# EAGLE design SparkFun CAN-Bus Shield v20 (EAGLE 9.6.2)
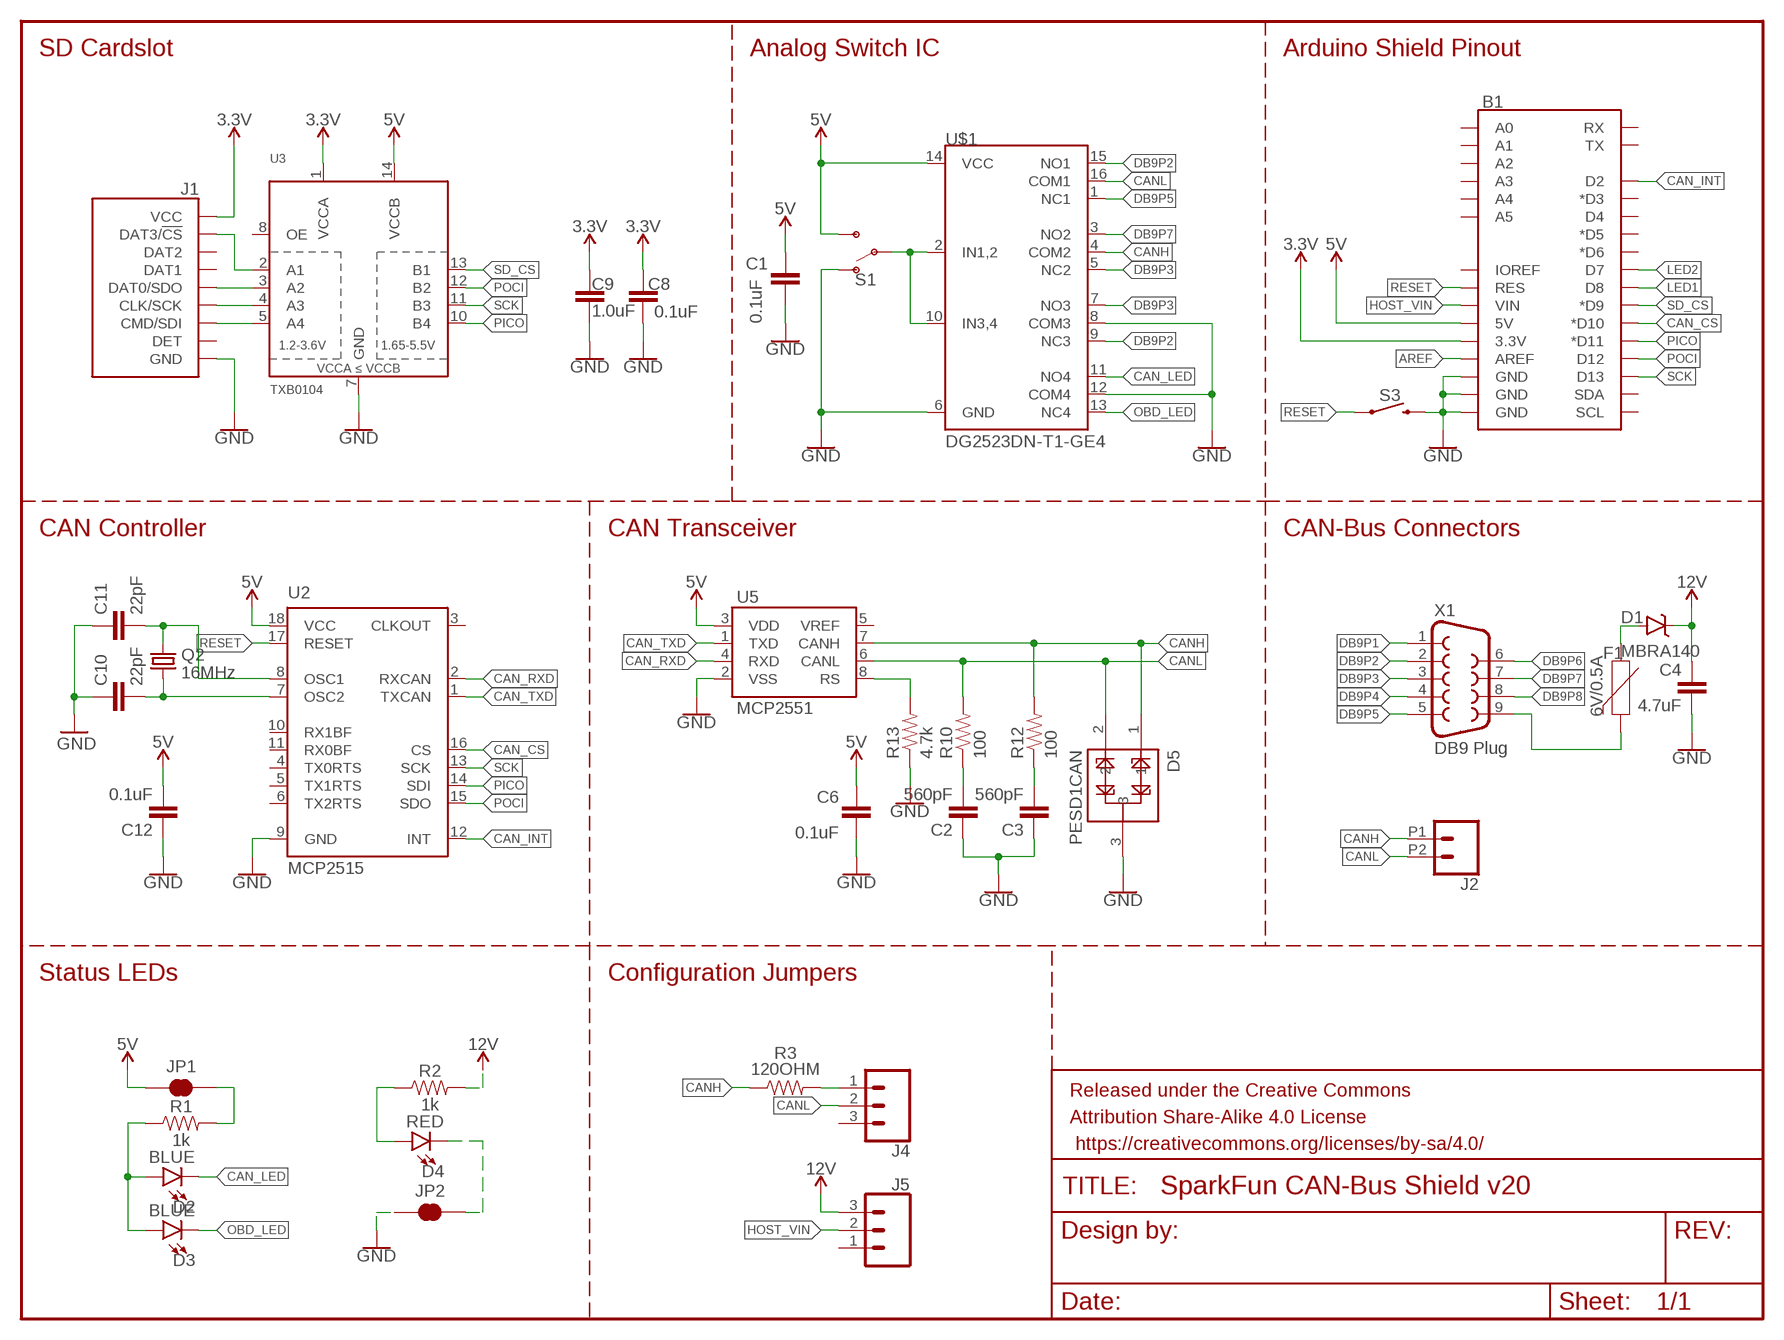
[diagram p0: schematic, sheet 1]

## Parts
B1  ARDUINO_UNO_R3_SHIELDUNO_R3_SHIELD_LOCK  [UNO_R3_SHIELD_LOCK]
C1  0.1uF  0.1UF-0603-25V-(+80/-20%)  [0603]
C2  560pF  560PF-0603-50V-5%  [0603]
C3  560pF  560PF-0603-50V-5%  [0603]
C4  4.7uF  4.7UF-0603-35V-(20%)  [0603]
C6  0.1uF  0.1UF-0603-25V-(+80/-20%)  [0603]
C8  0.1uF  0.1UF-0603-25V-(+80/-20%)  [0603]
C9  1.0uF  1.0UF-0603-16V-10%  [0603]
C10  22pF  22PF-0603-50V-5%  [0603]
C11  22pF  22PF-0603-50V-5%  [0603]
C12  0.1uF  0.1UF-0603-25V-(+80/-20%)  [0603]
D1  MBRA140  [SMA-DIODE]
D2  BLUE  LED-BLUE0603  [LED-0603]
D3  BLUE  LED-BLUE0603  [LED-0603]
D4  RED  LED-RED0603  [LED-0603]
D5  PESD1CAN  [SOT23-3]
F1  6V/0.5A  PPTC_6V500MA-2  [1206]
FRAME1  FRAME-LETTER  [CREATIVE_COMMONS]
J1  MICRO-SD-PUSH-PUSH-EXT-PIN  [MICROSD-EXTERNALPIN]
J2  CONN_022.54MM_SCREWTERM  [1X02_2.54_SCREWTERM]
J4  CONN_031X03_NO_SILK  [1X03_NO_SILK]
J5  CONN_031X03_NO_SILK  [1X03_NO_SILK]
JP1  JUMPER-SMT_2_NC_TRACE_NO-SILK  [SMT-JUMPER_2_NC_TRACE_NO-SILK]
JP2  JUMPER-SMT_2_NC_TRACE_NO-SILK  [SMT-JUMPER_2_NC_TRACE_NO-SILK]
Q2  16MHz  CRYSTAL-16MHZSMD-5X3.2  [CRYSTAL-SMD-5X3.2-4PAD]
R1  1k  1KOHM-0603-1/10W-1%  [0603]
R2  1k  1KOHM-0603-1/10W-1%  [0603]
R3  120OHM  [0603]
R10  100  100OHM-0603-1/10W-1%  [0603]
R12  100  100OHM-0603-1/10W-1%  [0603]
R13  4.7k  4.7KOHM-0603-1/10W-1%  [0603]
S1  SWITCH-SPDT-SMD-AYZ0202  [SWITCH_DPDT_SMD_AYZ0202]
S3  MOMENTARY-SWITCH-SPST-SMD-5.2-TALL-REDUNDANT  [TACTILE_SWITCH_SMD_5.2MM]
U2  MCP2515  MCP2515(MCP2510)SO  [SO18W]
U3  TXB0104  TXB0104PWRSOIC14  [SO14]
U5  MCP2551  [SO08]
U$1  DG2523DN-T1-GE4  [QFN16-3X3MM_1:1_V03]
X1  DB9 Plug  DB9MALE  [DB9_MALE]

## Nets
3.3V: B1.3.3V C8.2 C9.1 J1.4(VCC) U3.1(VCCA)
5V: B1.5V C1.2 C6.2 C12.2 JP1.1 S1.3(S) U2.18(VCC) U3.14(VCCB) U5.3(VDD) U$1.14(VCC)
12V: C4.1 D1.C J5.3 R2.2
AREF: B1.AREF
CAN_CS: B1.D10(*D10) U2.16(CS)
CAN_INT: B1.D2 U2.12(INT)
CAN_LED: D2.C U$1.11(NO4)
CAN_RXD: U2.2(RXCAN) U5.4(RXD)
CAN_TXD: U2.1(TXCAN) U5.1(TXD)
CANH: D5.1 J2.P1 R3.1 R12.2 U5.7(CANH) U$1.4(COM2)
CANL: D5.2 J2.P2 J4.2 R10.2 U5.6(CANL) U$1.16(COM1)
DB9P1: X1.1
DB9P2: U$1.9(NC3) U$1.15(NO1) X1.2
DB9P3: U$1.5(NC2) U$1.7(NO3) X1.3
DB9P4: X1.4
DB9P5: U$1.1(NC1) X1.5
DB9P6: X1.6
DB9P7: U$1.3(NO2) X1.7
DB9P8: X1.8
GND: B1.GND@0(GND) B1.GND@1(GND) B1.GND@2(GND) C1.1 C2.1 C3.1 C4.2 C6.1 C8.1 C9.2 C10.1 C11.1 C12.1 D5.3 J1.6(GND) J1.10(GND) J1.11(GND) J1.12(GND) J1.13(GND) JP2.1 R13.1 S3.3 S3.4 U2.9(GND) U3.7(GND) U5.2(VSS) U$1.8(COM3) U$1.12(COM4)
HOST_VIN: B1.VIN J5.2
LED1: B1.D8
LED2: B1.D7
N$1: C11.2 Q2.3 U2.8(OSC1)
N$2: C10.2 Q2.1 U2.7(OSC2)
N$3: J1.2(DAT3/!CS!) U3.2(A1)
N$4: S1.1(O) U$1.6(GND) ; supply symbol labelled GND
N$5: J1.7(DAT0/SDO) U3.3(A2)
N$6: J1.5(CLK/SCK) U3.4(A3)
N$7: J1.3(CMD/SDI) U3.5(A4)
N$8: D4.A R2.1
N$9: C2.2 R10.1
N$10: C3.2 R12.1
N$11: JP1.2 R1.2
N$12: D2.A D3.A R1.1
N$13: F1.2 X1.9
N$14: R13.2 U5.8(RS)
N$15: D4.C JP2.2
N$16: D1.A F1.1
N$17: J4.1 R3.2
N$21: S1.2(P) U$1.2(IN1,2) U$1.10(IN3,4)
OBD_LED: D3.C U$1.13(NC4)
PICO: B1.D11(*D11) U2.14(SDI) U3.10(B4)
POCI: B1.D12 U2.15(SDO) U3.12(B2)
RESET: B1.RES S3.1 S3.2 U2.17(RESET)
SCK: B1.D13 U2.13(SCK) U3.11(B3)
SD_CS: B1.D9(*D9) U3.13(B1)
Unconnected: B1.A0 B1.A1 B1.A2 B1.A3 B1.A4 B1.A5 B1.D3(*D3) B1.D4 B1.D5(*D5) B1.D6(*D6) B1.IOREF B1.RX B1.SCL B1.SDA B1.TX J1.1(DAT2) J1.8(DAT1) J1.9(DET) J4.3 J5.1 U2.3(CLKOUT) U2.4(TX0RTS) U2.5(TX1RTS) U2.6(TX2RTS) U2.10(RX1BF) U2.11(RX0BF) U3.8(OE) U5.5(VREF)

## Notes on the sheet
- SD Cardslot | Analog Switch IC | Arduino Shield Pinout
- CAN Controller | CAN Transceiver | CAN-Bus Connectors
- Status LEDs | Configuration Jumpers

## Library data of the parts
B1 = SparkFun-Boards:ARDUINO_UNO_R3_SHIELD: Arduino R3 Shield Footprint Shield form compatible with the Arduino Uno R3. SparkFun Products: MG2639 Cellular Shield <https://www.sparkfun.com/products/13120> MIDI Shield <https://www.sparkfun.com/products/12898> R3 Stackable Headers Kit <https://www.sparkfun.com/products/11417>
C1 C6 C8 C12 = SparkFun-Capacitors:0.1UF: 0.1µF ceramic capacitors A capacitor is a passive two-terminal electrical component used to store electrical energy temporarily in an electric field.; PROD_ID: CAP-00810
C2 C3 = SparkFun-Capacitors:560PF: 0.56nF/560pF ceramic capacitors A capacitor is a passive two-terminal electrical component used to store electrical energy temporarily in an electric field.; PROD_ID: CAP-08749
C4 = SparkFun-Capacitors:4.7UF: 4.7µF ceramic capacitors A capacitor is a passive two-terminal electrical component used to store electrical energy temporarily in an electric field.; PROD_ID: CAP-14106
C9 = SparkFun-Capacitors:1.0UF: 1µF ceramic capacitors A capacitor is a passive two-terminal electrical component used to store electrical energy temporarily in an electric field.; PROD_ID: CAP-00868
C10 C11 = SparkFun-Capacitors:22PF: 22pF ceramic capacitors A capacitor is a passive two-terminal electrical component used to store electrical energy temporarily in an electric field.; PROD_ID: CAP-07876
D1 = SparkFun-DiscreteSemi:MBRA140: 40V, 1A Schottky rectifier SMA/DO-214AC package DIO-08053; PROD_ID: DIO-08053
D2 D3 = SparkFun-LED:LED-BLUE: Blue SMD LED Used in manufacturing of various products at SparkFun Packages: 0603 - SMD 0603 package [Product Link] <http://www.digikey.com/product-detail/en/SMLE12BC7TT86/511-1589-2-ND/1641808> 1206 - SMD1206 package [Product Link] <http://www.digikey.com/product-detail/en/lite-on-inc/LTST-C150TBKT/160-1643-1-ND/573584> SparkFun Products: ESP8266 Thing-Dev Board <https://www.sparkfun.com/products/13711> RedBoard <https://www.sparkfun.com/products/12757>; PROD_ID: DIO-08575
D4 = SparkFun-LED:LED-RED: Red SMD LED Used in manufacturing of most products at SparkFun Packages: 0603 - SMD 0603 package [Product Link] <http://docs.avagotech.com/docs/AV02-0551EN> 0603 SMART - SMD 0603 SMART package ( more efficient and expensive)[Product Link] <http://www.osram-os.com/Graphics/XPic2/00077099_0.pdf> 1206 - SMD1206 package [Product Link] <https://www.sparkfun.com/datasheets/DevTools/LilyPad/Q150OVS4.pdff> SparkFun Products: Pro Mini 328 -5V <https://www.sparkfun.com/products/821> RedBoard <https://www.sparkfun.com/products/12757> IOIO-OTG <https://www.sparkfun.com/products/13613>; PROD_ID: DIO-00819
D5 = SparkFun-DiscreteSemi:PESD1CAN: PESD1CAN is used to protect two automotive CAN bus lines from ESD.; PROD_ID: DIO-12501
F1 = SparkFun-Fuses:PPTC: Resettable Fuse PPTC Resettable Fuse. Really a sort of resistor with a polymeric positive temperature coefficient whose resistance increases dramatically with an increase in temperature. When heated by the power passing through the resistance rises causing the current to be limited, protecting the circuit. This is achieved by the transition of the polymer from a crystalline to an amorphous state where the conductive carbon separates breaking the conductive pathways found in the cool crystalline structure. When a PPTC cools back down it resumes conducting letting the circuit turn back on. SparkFun Products: SparkFun RedBoard - Programmed with Arduino <https://www.sparkfun.com/products/12757> Pro Micro - 5V/16MHz <https://www.sparkfun.com/products/12640> Arduino Pro 328 - 5V/16MHz <https://www.sparkfun.com/products/10915> MP3 Trigger <https://www.sparkfun.com/products/13720>; PROD_ID: RES-08585
FRAME1 = SparkFun-Aesthetics:FRAME-LETTER: Schematic Frame - Letter Standard 8.5x11 US Letter frame
J1 = SparkFun-Connectors:MICRO-SD: microSD Socket for Transflash Various sockets for µSD. tDoc lines correctly indicate media card edge positions when inserting (unlocked, locked, depressed). NOTE: CD1 and CD2 are connected internally, and the default detect state of the socket is detect pin to ground. SparkFun Products: WAV Trigger <https://www.sparkfun.com/products/13660> CAN-Bus Shield <https://www.sparkfun.com/products/13262> SparkFun Level Shifing microSD Breakout <https://www.sparkfun.com/products/13743>; PROD_ID: CONN-16110
J2 = SparkFun-Connectors:CONN_02: Multi connection point. Often used as Generic Header-pin footprint for 0.1 inch spaced/style header connections On any of the 0.1 inch spaced packages, you can populate with these: Break Away Headers - Straight <https://www.sparkfun.com/products/116> (PRT-00116) Break Away Male Headers - Right Angle <https://www.sparkfun.com/products/553> (PRT-00553) Female Headers <https://www.sparkfun.com/products/115> (PRT-00115) Break Away Headers - Machine Pin <https://www.sparkfun.com/products/117> (PRT-00117) Break Away Female Headers - Swiss Machine Pin <https://www.sparkfun.com/products/743> (PRT-00743) For SCREWTERMINALS and SPRING TERMINALS visit here: Screw Terimnals on SparkFun.com <https://www.sparkfun.com/search/results?term=Screw+Terminals> (5mm/3.5mm/2.54mm spacing) This device is also useful as a general connection point to wire up your design to another part of your project. Our various solder wires solder well into these plated through hole pads. Hook-Up Wire - Assortment (Stranded, 22 AWG) <https://www.sparkfun.com/products/11375> (PRT-11375) Hook-Up Wire - Assortment (Solid Core, 22 AWG) <https://www.sparkfun.com/products/11367> (PRT-11367) View the entire wire category on our website here <https://www.sparkfun.com/categories/141> Special notes: Molex polarized connector foot print use with: PRT-08233 with associated crimp pins and housings. 2.54_SCREWTERM for use with PRT-10571. 3.5mm Screw Terminal footprints for PRT-08084 5mm Screw Terminal footprints for use with PRT-08432
J4 J5 = SparkFun-Connectors:CONN_03: Multi connection point. Often used as Generic Header-pin footprint for 0.1 inch spaced/style header connections On any of the 0.1 inch spaced packages, you can populate with these: Break Away Headers - Straight <https://www.sparkfun.com/products/116> (PRT-00116) Break Away Male Headers - Right Angle <https://www.sparkfun.com/products/553> (PRT-00553) Female Headers <https://www.sparkfun.com/products/115> (PRT-00115) Break Away Headers - Machine Pin <https://www.sparkfun.com/products/117> (PRT-00117) Break Away Female Headers - Swiss Machine Pin <https://www.sparkfun.com/products/743> (PRT-00743) Stackable Header - 3 Pin (Female, 0.1") <https://www.sparkfun.com/products/13875> (PRT-13875) For SCREWTERMINALS and SPRING TERMINALS visit here: Screw Terimnals on SparkFun.com <https://www.sparkfun.com/search/results?term=Screw+Terminals> (5mm/3.5mm/2.54mm spacing) This device is also useful as a general connection point to wire up your design to another part of your project. Our various solder wires solder well into these plated through hole pads. Hook-Up Wire - Assortment (Stranded, 22 AWG) <https://www.sparkfun.com/products/11375> (PRT-11375) Hook-Up Wire - Assortment (Solid Core, 22 AWG) <https://www.sparkfun.com/products/11367> (PRT-11367) View the entire wire category on our website here <https://www.sparkfun.com/categories/141> Special notes: Molex polarized connector foot print use with SKU : PRT-08232 with associated crimp pins and housings.
JP1 JP2 = SparkFun-Jumpers:JUMPER-SMT_2_NC_TRACE: Normally closed trace jumper This jumper has a trace between two pads so it's normally closed (NC). Use a razor knife to open the connection. For best results follow the IPC guidelines for cutting traces: Cutout at least 0.063 mm (0.005 in). Remove all loose material to clean up the cut area. Seal the cut with an approved epoxy. Reapply solder to reclose the connection.
Q2 = SparkFun-Clocks:CRYSTAL-16MHZ: 16MHz Crystal Digikey Example <http://www.digikey.com/product-search/en?keywords=535-9122-1-ND> Frequency: 16MHz Frequency Stability: ±50ppm Frequency Tolerance: ±20ppm Load Capacitance: 18pF SparkFun Products: Pro Micro -5V/16MHz <https://www.sparkfun.com/products/12640> SparkFun Serial Enabled LCD Kit <https://www.sparkfun.com/products/10097>; PROD_ID: XTAL-08218; SF_ID: COM-00094
R1 R2 = SparkFun-Resistors:1KOHM: 1kΩ resistor A resistor is a passive two-terminal electrical component that implements electrical resistance as a circuit element. Resistors act to reduce current flow, and, at the same time, act to lower voltage levels within circuits. - Wikipedia; PROD_ID: RES-07856
R3 = SparkFun-Resistors:120OHM: 120Ω resistor A resistor is a passive two-terminal electrical component that implements electrical resistance as a circuit element. Resistors act to reduce current flow, and, at the same time, act to lower voltage levels within circuits. - Wikipedia
R10 R12 = SparkFun-Resistors:100OHM: 100Ω resistor A resistor is a passive two-terminal electrical component that implements electrical resistance as a circuit element. Resistors act to reduce current flow, and, at the same time, act to lower voltage levels within circuits. - Wikipedia; PROD_ID: RES-07863
R13 = SparkFun-Resistors:4.7KOHM: 4.7kΩ resistor A resistor is a passive two-terminal electrical component that implements electrical resistance as a circuit element. Resistors act to reduce current flow, and, at the same time, act to lower voltage levels within circuits. - Wikipedia; PROD_ID: RES-07857
S1 = SparkFun-Switches:SWITCH-SPDT: Single Pole, Double Throw (SPDT) Switch Single-pole, double-throw (SPDT) switch. Variant Overview SMD-AYZ0202 Surface Mount DPDT Switch <https://www.sparkfun.com/products/597> (COM-00597) Used on e.g. LilyPad Arduino USB - ATmega32U4 Board <https://www.sparkfun.com/products/12049> PTH-11.6X4.0MM SPDT Mini Power Switch <https://www.sparkfun.com/products/102> (COM-00102) Used on e.g. SparkFun Simon Says - Through-Hole Soldering Kit <https://www.sparkfun.com/products/10547> (KIT-10547) PTH-11.6X4.0MM-KIT KIT version of SPDT Mini Power Switch - Simplifies soldering by removing tStop of switch pins - only one side can be soldered. PTH-11.6X4.0MM-LOCK LOCK version of SPDT Mini Power Switch - Offset pins hold switch in place for easier soldering. SMD-RIGHT-ANGLE Surface Mount Right Angle Switch <https://www.sparkfun.com/products/10860> (COM-10860) Used on e.g. SparkFun ESP8266 Thing <https://www.sparkfun.com/products/13231>; PROD_ID: SWCH-08179; SF_ID: COM-00597
S3 = SparkFun-Switches:MOMENTARY-SWITCH-SPST: Momentary Switch (Pushbutton) - SPST Normally-open (NO) SPST momentary switches (buttons, pushbuttons). Variants PTH-12MM - 12mm square, through-hole Momentary Pushbutton Switch - 12mm Square <https://www.sparkfun.com/products/9190> (COM-09190) PTH-6.0MM, PTH-6.0MM-KIT - 6.0mm square, through-hole Mini Pushbutton Switch <https://www.sparkfun.com/products/97> (COM-00097) KIT package intended for soldering kit's - only one side of pads' copper is exposed. PTH-RIGHT-ANGLE-KIT - Right-angle, through-hole Right Angle Tactile Button <https://www.sparkfun.com/products/10791> - Used on SparkFun BigTime Watch Kit <https://www.sparkfun.com/products/11734> SMD-12MM - 12mm square, surface-mount Tactile Button - SMD (12mm) <https://www.sparkfun.com/products/12993> (COM-12993) Used on SparkFun PicoBoard <https://www.sparkfun.com/products/11888> SMD-4.5MM - 4.5mm Square Trackball Switch Used on SparkFun Blackberry Trackballer Breakout <https://www.sparkfun.com/products/13169> SMD-4.6MMX2.8MM - 4.60mm x 2.80mm, surface mount Used on SparkFun Pro Micro - RP2040 <https://www.sparkfun.com/products/17717> SMD-5.2MM, SMD-5.2-REDUNDANT - 5.2mm square, surface-mount Mini Pushbutton Switch - SMD <https://www.sparkfun.com/products/8720> (COM-08720) Used on Arduino Pro Mini <https://www.sparkfun.com/products/11114> REDUNDANT package connects both switch circuits together SMD-6.0X3.5MM - 6.0 x 3.5mm, surface mount Momentary Reset Switch SMD <https://www.sparkfun.com/products/8229> (COM-08229) SMD-6.2MM-TALL - 6.2mm square, surface mount Tactile Button - SMD (6mm) <https://www.sparkfun.com/products/12992> Used on SparkFun Digital Sandbox <https://www.sparkfun.com/products/12651> SMD-RIGHT-ANGLE - Right-angle, surface mount Used on SparkFun Block for Intel® Edison - Arduino <https://www.sparkfun.com/products/13036>; PROD_ID: SWCH-14139
U2 = SparkFun-IC-Comms:MCP2515(MCP2510): CAN controller with SPI interface The MCP2515 controller supercedes the MCP2510 while addressing all errata associated with it. The two devices are pin compatible, either can be used with this device. 18-pin package SOIC Simple SPI interface to any MCU. One-shot mode ensures message transmission is attempted only once Databyte filtering Start-of-Frame (SOF) output Low-power CMOS Technology Datasheet <http://www.sparkfun.com/datasheets/DevTools/Arduino/MCP2515.pdf> SparkFun Products CAN-BUS Shield <https://www.sparkfun.com/products/13262> (DEV-13262); PROD_ID: IC-09906
U3 = SparkFun-IC-Comms:TXB0104PWR: 4-Bit Bi-Directional Level Shifter 1.2V-3.6V (VCCA) to 1.65V-5.5V (VCCB) bi-directional level shifter with auto direction sensing. Max data rate - VCCA 1.8V: 20Mbps (50ns), VCCA 3.3V: 100Mbps (10ns) Digikey: 296-21929-1-ND (TSSOP) Datasheet <http://cdn.sparkfun.com/datasheets/BreakoutBoards/txb0104.pdf> SparkFun Products SparkFun Cellular Shield - MG2639 <https://www.sparkfun.com/products/13120> (CEL-13120) SparkFun Level Shifting microSD Breakout <https://www.sparkfun.com/products/13743> (DEV-13743) SparkFun Voltage-Level Translator Breakout - TXB0104 <https://www.sparkfun.com/products/11771> (BOB-11771) SparkFun Block for Intel® Edison - UART <https://www.sparkfun.com/products/13040> (DEV-13040) SparkFun Block for Intel® Edison - Arduino <https://www.sparkfun.com/products/13036> (DEV-13036); PROD_ID: IC-11329
U5 = SparkFun-IC-Comms:MCP2551: MCP2551 High Speed CAN Transceiver High speed CAN transceiver Datasheet <http://www.sparkfun.com/datasheets/DevTools/Arduino/MCP2551.pdf> SparkFun Products CAN-BUS Shield <https://www.sparkfun.com/products/13262> (DEV-13262) SparkFun OBD-II UART <https://www.sparkfun.com/products/9555> (WIG-09555); PROD_ID: IC-09907
U$1 = SparkFun-IC-Special-Function:DG2523DN-T1-GE4
X1 = SparkFun-Connectors:DB9: DB9 Connector Standard DB9 (D-Sub 9) serial connector. Can be used for CAN bus as well as RS485 and RS232. Footprint production proven. Spark Fun Electronics SKU : PRT-00429; PROD_ID: CONN-09904

## Board
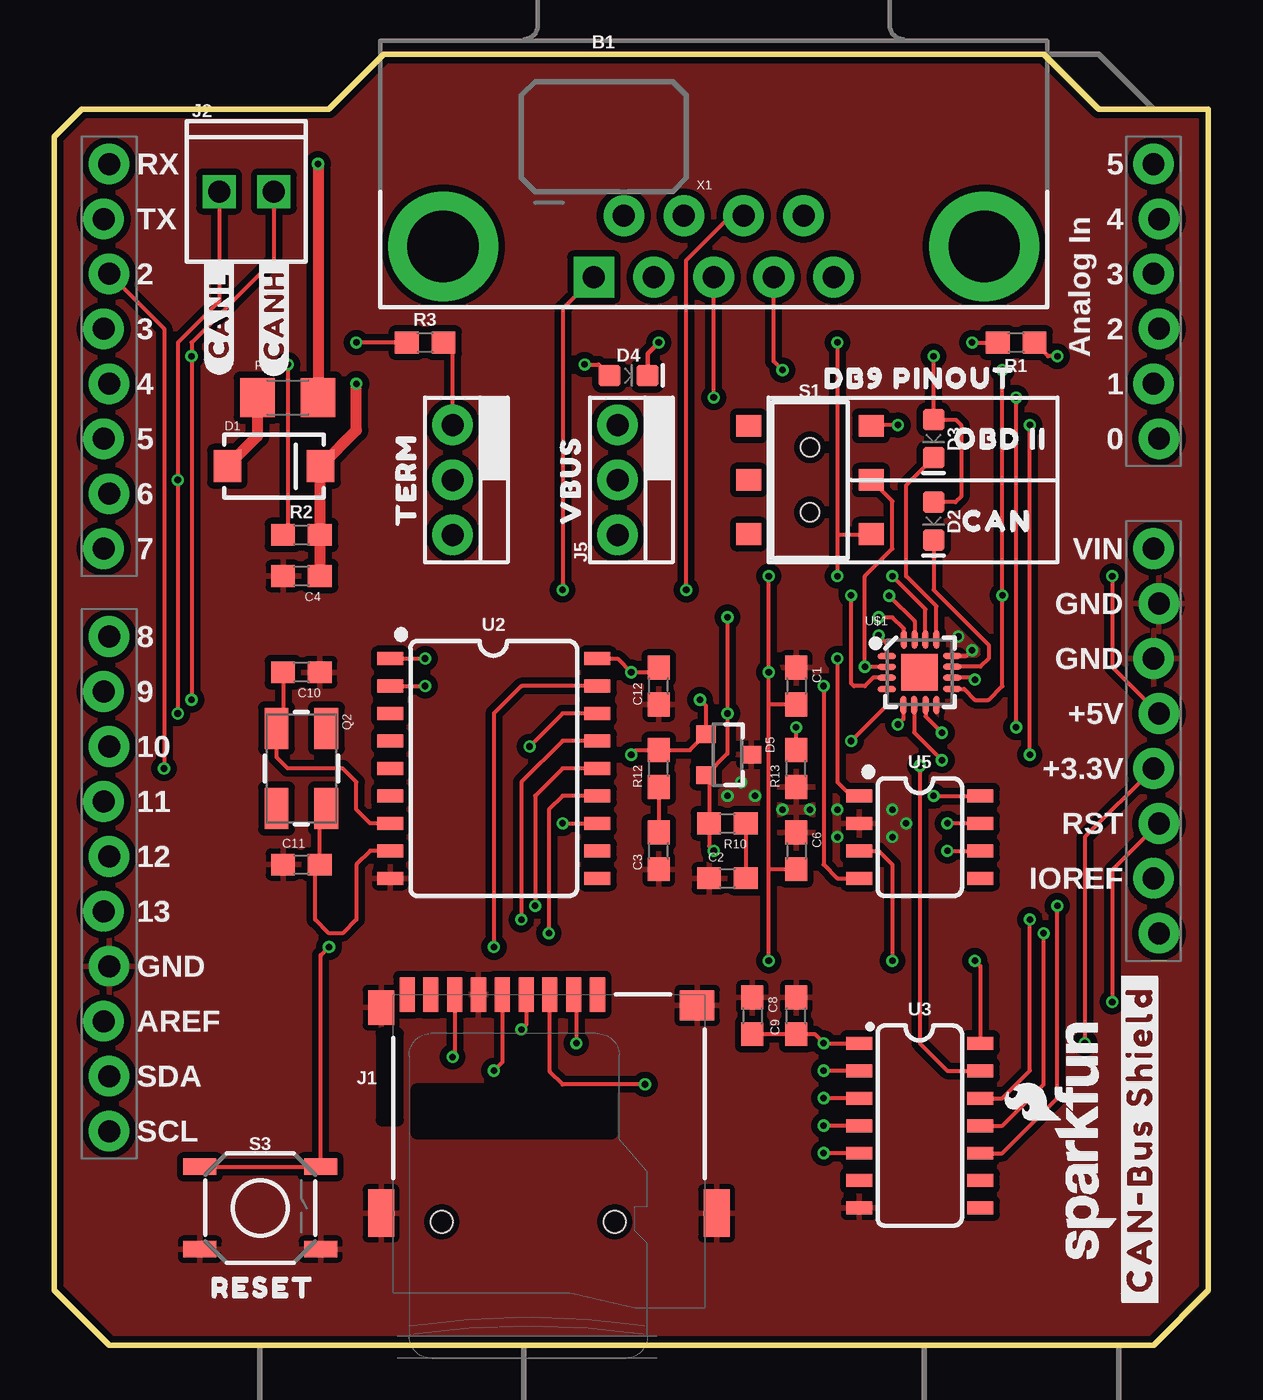
[diagram p1: board, top side]
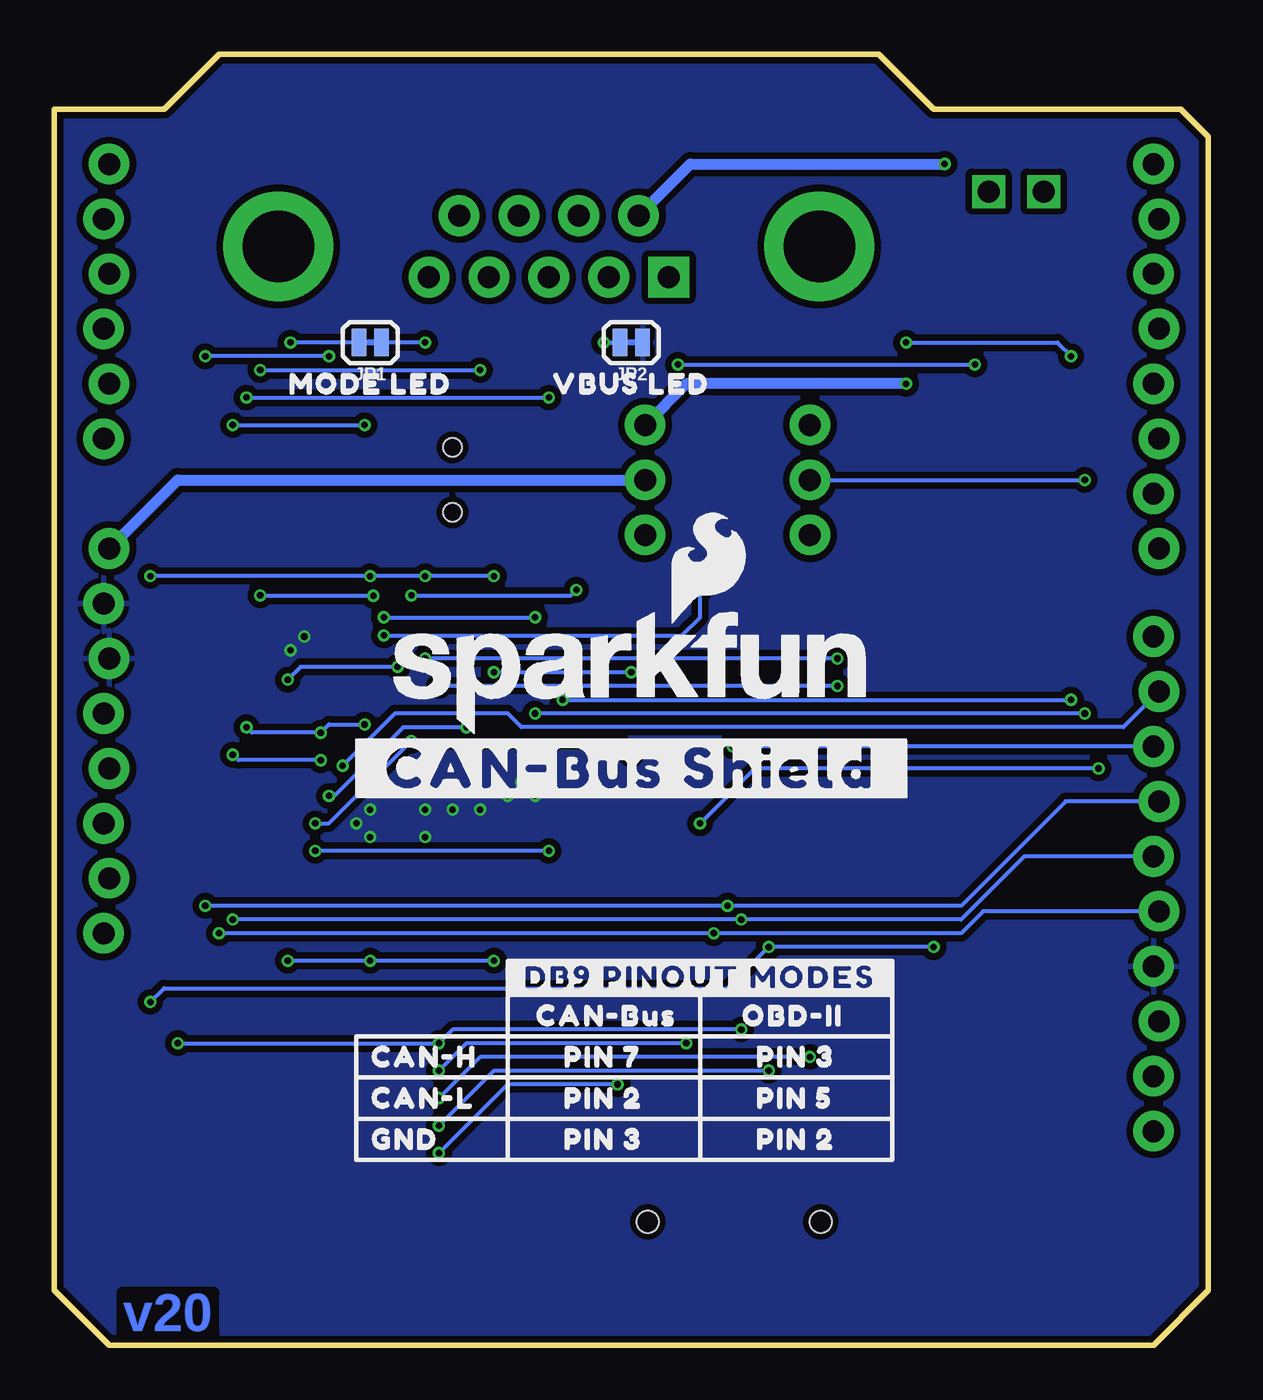
[diagram p2: board, bottom side, seen from below]

Size 53.34 x 59.69 mm. Coordinates in mm from the lower left corner, seen from the top.
Outline: 0,2.54 2.54,0 50.8,0 53.34,2.54 53.34,57.15 48.26,57.15 45.72,59.69 15.24,59.69 12.7,57.15 1.27,57.15 0,55.88 0,2.54
Copper layers (1*16): Top 0.035mm / dielectric 1.5mm / Bottom 0.035mm
Design rules "SparkFun-2-Layer-Minimum-JLCPCB": minimum track width 5mil, minimum drill 0.3mm, track to track 5mil, track to pad 5mil, pad to pad 5mil, via to via 5mil, smd to smd 5mil, copper to edge 7mil, drill to drill 7mil, minimum pad ring 5mil, minimum via ring 5mil, stop-mask expansion 4mil, vias tented up to drill 25mil, thermal gap 10mil

### Footprints (pad centres in the part's own frame; a part is rotated, then mirrored left to right if it is on the bottom)
UNO_R3_SHIELD_LOCK = drill 1.016 pad 1.88: 3.3V 24.13,-3.81; 5V 24.384,-1.27; A0 24.384,11.43; A1 24.13,13.97; A2 24.384,16.51; A3 24.13,19.05; A4 24.384,21.59; A5 24.13,24.13; AREF -24.384,-15.494; D2 -24.13,19.05; D3 -24.384,16.51; D4 -24.13,13.97; D5 -24.384,11.43; D6 -24.13,8.89; D7 -24.384,6.35; D8 -24.13,2.286; D9 -24.384,-0.254; D10 -24.13,-2.794; D11 -24.384,-5.334; D12 -24.13,-7.874; D13 -24.384,-10.414; GND@0 24.13,1.27; GND@1 24.384,3.81; GND@2 -24.13,-12.954; IOREF 24.13,-8.89; NC 24.384,-11.43; RES 24.384,-6.35; RX -24.13,24.13; SCL -24.13,-20.574; SDA -24.13,-18.034; TX -24.384,21.59; VIN 24.13,6.35
0603 = smd 1.1 x 1: 1 -0.85,0; 2 0.85,0
SMA-DIODE = smd 1.27 x 1.47: A -2.15,0; C 2.15,0
LED-0603 = smd 1 x 1: A -0.877,0; C 0.877,0
SOT23-3 = smd 0.8 x 0.9: 1 -0.95,-1; 2 0.95,-1; 3 0,1.1
1206 = smd 1.6 x 1.8: 1 -1.4,0; 2 1.4,0
MICROSD-EXTERNALPIN = smd 0.7 x 1.6: 1 2.25,10.5; 2 1.15,10.5; 3 0.05,10.5; 4 -1.05,10.5; 5 -2.15,10.5; 6 -3.25,10.5; 7 -4.35,10.5; 8 -5.45,10.5; 9 -6.55,10.5 | smd 1.2 x 1.6: 10 -7.75,9.9 | smd 1.2 x 2.2: 11 -7.75,0.4; 12 7.75,0.4 | smd 1.6 x 1.4: 13 6.85,10 | hole 1: 3.05,0; -4.95,0
1X02_2.54_SCREWTERM = drill 1.016 square: P1 2.54,0; P2 0,0
1X03_NO_SILK = drill 1.016 pad 1.88: 1 0,0; 2 2.54,0; 3 5.08,0
SMT-JUMPER_2_NC_TRACE_NO-SILK = smd 0.66 x 1.27: 1 -0.521,0; 2 0.521,0
CRYSTAL-SMD-5X3.2-4PAD = smd 1.9 x 1.1: 1 -1.85,-1.15; 2 1.85,-1.15; 3 1.85,1.15; 4 -1.85,1.15
SWITCH_DPDT_SMD_AYZ0202 = smd 1 x 1.15: 1 -2.5,2.825; 2 0,2.825; 3 2.5,2.825; 4 -2.5,-2.825; 5 0,-2.825; 6 2.5,-2.825 | hole 0.85: 1.5,0; -1.5,0
TACTILE_SWITCH_SMD_5.2MM = smd 1.524 x 0.762: 1 -2.794,1.905; 2 2.794,1.905; 3 -2.794,-1.905; 4 2.794,-1.905
SO18W = smd 0.6 x 1.2: 1 -5.08,-4.788; 2 -3.81,-4.788; 3 -2.54,-4.788; 4 -1.27,-4.788; 5 0,-4.788; 6 1.27,-4.788; 7 2.54,-4.788; 8 3.81,-4.788; 9 5.08,-4.788; 10 5.08,4.788; 11 3.81,4.788; 12 2.54,4.788; 13 1.27,4.788; 14 0,4.788; 15 -1.27,4.788; 16 -2.54,4.788; 17 -3.81,4.788; 18 -5.08,4.788
SO14 = smd 0.6 x 1.2: 1 -3.81,-2.8; 2 -2.54,-2.8; 3 -1.27,-2.8; 4 0,-2.8; 5 1.27,-2.8; 6 2.54,-2.8; 7 3.81,-2.8; 8 3.81,2.8; 9 2.54,2.8; 10 1.27,2.8; 11 0,2.8; 12 -1.27,2.8; 13 -2.54,2.8; 14 -3.81,2.8
SO08 = smd 0.6 x 1.2: 1 -1.905,-2.8; 2 -0.635,-2.8; 3 0.635,-2.8; 4 1.905,-2.8; 5 1.905,2.8; 6 0.635,2.8; 7 -0.635,2.8; 8 -1.905,2.8
QFN16-3X3MM_1:1_V03 = smd 0.85 x 0.28: 1 -1.524,0.75; 2 -1.524,0.253; 3 -1.529,-0.25; 4 -1.527,-0.774; 9 1.503,-0.77; 10 1.498,-0.245; 11 1.498,0.255; 12 1.495,0.755 | smd 0.28 x 0.85: 5 -0.765,-1.513; 6 -0.265,-1.513; 7 0.263,-1.513; 8 0.763,-1.513; 13 0.758,1.518; 14 0.258,1.518; 15 -0.247,1.518; 16 -0.742,1.518 | smd 1.68 x 1.68: EXT -0.009,0.008
DB9_MALE = drill 1.016 pad 1.88: 1 5.54,-1.42; 2 2.77,-1.42; 3 0,-1.42; 4 -2.77,-1.42; 6 4.15,1.42; 7 1.38,1.42; 8 -1.38,1.42; 9 -4.15,1.42 | drill 1.016 pad 1.88 square: 5 -5.54,-1.42 | drill 3.302 pad 5.08: G1 -12.5,0; G2 12.5,0

### Placement (x,y rotation side)
B1  26.67,30.48 0 top
C1  34.29,30.48 270 top
C2  31.11,21.59 0 top
C3  27.94,22.86 90 top
C4  11.43,35.56 180 top
C6  34.29,22.86 270 top
C8  32.26,15.24 270 top
C9  34.29,15.24 90 top
C10  11.43,31.11 180 top
C11  11.43,22.23 0 top
C12  27.94,30.48 90 top
D1  10.16,40.64 0 top
D2  40.64,38.1 270 top
D3  40.64,41.91 270 top
D4  26.54,44.83 0 top
D5  31.11,27.3 270 top
F1  10.79,43.81 0 top
FRAME1  5.08,-27.94 0 top  (outside the outline)
J1  22.86,5.71 0 top
J2  7.62,53.34 0 top
J4  18.41,42.55 270 top
J5  26.04,37.47 90 top
JP1  38.73,46.35 180 bottom
JP2  26.67,46.35 180 bottom
Q2  11.43,26.67 270 top
R1  44.45,46.35 180 top
R2  11.43,37.47 0 top
R3  17.14,46.35 0 top
R10  31.11,24.13 180 top
R12  27.94,26.67 90 top
R13  34.29,26.67 90 top
S1  34.92,40.01 270 top
S3  9.53,6.35 0 top
U2  20.32,26.67 270 top
U3  40.01,10.16 270 top
U5  40.01,23.5 270 top
U$1  40.01,31.11 0 top
U$2  [TERM0]  16.26,40.01 90 top
U$3  [VBUS0]  23.88,40.01 90 top
U$4  [OBD_II0]  40.89,41.91 0 top
U$5  [CAN0]  41.27,38.1 0 top
U$6  [RESET0]  9.65,2.67 0 top
U$7  [DB9_PINOUT0]  40.01,44.7 0 top
U$8  [#CANH#0]  10.16,47.62 90 top
U$9  [#CANL#0]  7.62,47.62 90 top
U$10  [#CAN#BUS_SHIELD#0]  50.16,9.53 90 top
U$11  [SFE_LOGO_NAME_FLAME_.1]  47.62,9.53 90 top
U$12  [#_CAN#BUS_SHIELD_#0]  26.67,26.67 0 bottom
U$13  [SFE_LOGO_NAME_FLAME_.2]  26.67,31.11 0 bottom
U$14  [#DB9_PINOUT_MODES#0]  32.38,17.02 0 bottom
U$15  [CAN#H0]  39.37,13.34 0 bottom
U$16  [CAN#L0]  39.37,11.43 0 bottom
U$17  [GND0]  39.37,9.53 0 bottom
U$18  [CAN#BUS0]  31.75,15.24 0 bottom
U$19  [OBD#II0]  22.23,15.24 0 bottom
U$20  [PIN_70]  30.48,13.34 0 bottom
U$21  [PIN_20]  30.48,11.43 0 bottom
U$22  [PIN_20]  21.59,9.53 0 bottom
U$23  [PIN_30]  21.59,13.34 0 bottom
U$24  [PIN_30]  30.48,9.53 0 bottom
U$25  [PIN_50]  21.59,11.43 0 bottom
U$26  [MODE_LED0]  38.73,44.45 0 bottom
U$27  [VBUS_LED0]  26.67,44.45 0 bottom
X1  30.48,50.8 0 top

### Tracks (layer width: path | path; a pad name or v marks a point on that pad's centre or on a via)
3.3V  (via drill 0.3)
  Top 0.178: U3.1 v35.56,13.97 35.14,14.39 C9.1 C8.2 | B1.3.3V 47.62,23.5 v47.62,13.97 | J1.4 21.81,14.82 v21.59,14.61
  Bottom 0.178: v47.62,13.97 v35.56,13.97 34.92,14.61 v21.59,14.61
5V  (via drill 0.3)
  Top 0.178: C1.2 33.02,29.63 | C6.2 33.02,22.01 | v33.02,17.78 33.02,22.01 | v42.55,17.78 42.8,17.52 U3.14 | U5.3 38.1,22.86 38.73,22.23 v38.73,17.78 | U2.18 26.04,31.75 v26.67,31.11 27.73,31.11 C12.2 | U$1.14 40.26,34.03 v38.73,35.56 | v48.9,35.56 48.9,31.37 B1.5V | v33.02,35.56 v33.02,31.11 33.02,29.63 | v36.2,46.35 36.2,37.47 | 36.2,37.47 v36.2,35.56 | S1.3 37.71,37.47 36.2,37.47 | 33.02,22.01 33.02,29.63
  Bottom 0.178: v36.2,46.35 JP1.1 | v33.02,17.78 v38.73,17.78 v42.55,17.78 | v26.67,31.11 v33.02,31.11 | v48.9,35.56 v38.73,35.56 v36.2,35.56 v33.02,35.56
12V  (via drill 0.3)
  Top 0.508: v13.97,44.45 13.97,42.3 D1.C 12.28,40.61 R2.2 C4.1
  Bottom 0.508: J5.3 24.13,44.45 v13.97,44.45
CAN_CS  (via drill 0.3)
  Top 0.178: U2.16 23.5,29.21 v21.97,27.69
  Bottom 0.178: B1.D10 v21.97,27.69
CAN_INT  (via drill 0.3)
  Top 0.178: B1.D2 5.08,46.99 v5.08,26.67 | v23.5,24.13 U2.12
  Bottom 0.178: v5.08,26.67 20.95,26.67 v23.5,24.13
CAN_LED
  Top 0.178: D2.C 40.64,34.92 43.18,32.38 43.18,31.75 42.8,31.37 U$1.11
CAN_RXD  (via drill 0.3)
  Top 0.178: U2.2 v17.14,30.48 | v35.56,30.48 35.56,22.23 36.2,21.59 U5.4
  Bottom 0.178: v17.14,30.48 v35.56,30.48
CAN_TXD  (via drill 0.3)
  Top 0.178: U2.1 v17.14,31.75 | v36.2,31.75 36.2,26.04 36.83,25.4 U5.1
  Bottom 0.178: v17.14,31.75 v36.2,31.75
CANH  (via drill 0.3)
  Top 0.178: J2.P1 10.16,50.16 6.35,46.35 v6.35,45.72 v6.35,29.84 | v29.84,29.84 30.11,29.57 D5.1 29.38,27.52 R12.2 26.89,27.52 v26.67,27.3 | U$1.4 38.48,29.59 v36.83,27.94 | U5.7 v41.27,24.13 | R3.1 v13.97,46.35
  Bottom 0.178: v29.84,29.84 v6.35,29.84 | v26.67,27.3 27.3,27.94 v36.83,27.94 40.64,24.13 v41.27,24.13 | v13.97,46.35 6.99,46.35 v6.35,45.72
CANL  (via drill 0.3)
  Top 0.178: J2.P2 7.62,48.26 5.71,46.35 v5.71,40.01 v5.71,29.21 | v31.11,33.66 v31.11,29.21 31.11,27.36 D5.2 30.27,26.2 R10.2 30.27,23.07 v30.48,22.86 | U$1.16 39.26,33.13 38.73,33.66 v38.1,33.66 | v41.27,22.86 U5.6
  Bottom 0.178: v5.71,29.21 v31.11,29.21 | v38.1,33.66 v31.11,33.66 | v30.48,22.86 v41.27,22.86 | J4.2 v5.71,40.01
DB9P2  (via drill 0.3)
  Top 0.178: U$1.9 42.05,30.34 42.55,29.84 43.18,29.84 43.81,30.48 v43.81,34.67 v43.81,45.09 | v38.59,34.65 39.76,33.48 U$1.15 | v33.66,45.09 33.25,45.49 X1.2
  Bottom 0.178: v43.81,34.67 38.61,34.67 v38.59,34.65 | v43.81,45.09 v33.66,45.09
DB9P3  (via drill 0.3)
  Top 0.178: U$1.5 39.24,28.95 v38.99,28.7 | U$1.7 40.27,29.07 v41.02,28.32 | v44.45,28.57 v44.45,43.81 | v30.48,43.81 X1.3
  Bottom 0.178: v38.99,28.7 40.64,28.7 v41.02,28.32 44.2,28.32 v44.45,28.57 | v44.45,43.81 v30.48,43.81
DB9P5  (via drill 0.3)
  Top 0.178: U$1.1 38.48,32.44 v38.1,32.82 | X1.5 23.5,47.94 v23.5,34.92
  Bottom 0.178: v38.1,32.82 24.33,32.82 23.5,33.66 v23.5,34.92
DB9P7  (via drill 0.3)
  Top 0.178: U$1.3 37.85,30.86 37.47,30.48 36.96,30.48 36.83,30.61 v36.83,34.67 | v29.21,34.92 29.21,50.16 31.27,52.22 X1.7
  Bottom 0.178: v36.83,34.67 29.46,34.67 v29.21,34.92
GND  (via drill 0.3)
  Top 0.178: U$1.12 42.16,31.87 v42.42,32.13
  other vias: 31.75,26.04 31.11,25.4 32.38,25.4 33.66,24.77 34.92,24.77 41.78,32.77 38.73,24.77 38.73,23.5 39.37,24.13 36.2,24.77 36.2,23.5
  pour Top (isolate 0.305): 0,2.54 2.54,0 50.8,0 53.34,2.54 53.34,57.15 48.26,57.15 45.72,59.69 15.24,59.69 12.7,57.15 1.27,57.15 0,55.88
  pour Bottom (isolate 0.305): 0,2.54 2.54,0 50.8,0 53.34,2.54 53.34,57.15 48.26,57.15 45.72,59.69 15.24,59.69 12.7,57.15 1.27,57.15 0,55.88
HOST_VIN
  Bottom 0.508: B1.VIN 47.62,40.01 J5.2
N$1
  Top 0.178: Q2.3 12.28,24.52 C11.2 12.06,22.01 12.06,19.68 12.7,19.05 13.34,19.05 13.97,19.68 13.97,22.23 14.61,22.86 U2.8
N$2
  Top 0.178: C10.2 10.58,28.82 Q2.1 10.28,27.18 10.79,26.67 13.34,26.67 13.97,26.04 13.97,24.77 14.61,24.13 U2.7
N$3  (via drill 0.3)
  Top 0.178: U3.2 v35.56,12.7 | J1.2 24.13,16.09 v24.13,13.97
  Bottom 0.178: v24.13,13.97 34.29,13.97 v35.56,12.7
N$4  (via drill 0.3)
  Top 0.178: U$1.6 39.74,28.33 v41.02,27.05 | v45.09,27.3 v45.09,42.55 | v38.99,42.55 37.79,42.55 S1.1
  Bottom 0.178: v41.02,27.05 44.83,27.05 v45.09,27.3 | v45.09,42.55 v38.99,42.55
N$5  (via drill 0.3)
  Top 0.178: U3.3 v35.56,11.43 | J1.7 18.51,13.43 v18.41,13.34
  Bottom 0.178: v18.41,13.34 33.66,13.34 v35.56,11.43
N$6  (via drill 0.3)
  Top 0.178: U3.4 v35.56,10.16 | J1.5 20.71,13.09 v20.32,12.7
  Bottom 0.178: v20.32,12.7 33.02,12.7 v35.56,10.16
N$7  (via drill 0.3)
  Top 0.178: U3.5 v35.56,8.89 | J1.3 22.91,12.65 23.5,12.06 v27.3,12.06
  Bottom 0.178: v27.3,12.06 32.38,12.06 v35.56,8.89
N$8  (via drill 0.3)
  Top 0.178: v10.79,45.34 10.79,37.68 R2.1 | v24.51,45.34 25.16,45.34 D4.A
  Bottom 0.178: v24.51,45.34 v10.79,45.34
N$9
  Top 0.178: R10.1 C2.2
N$10
  Top 0.178: R12.1 C3.2
N$11  (via drill 0.3)
  Top 0.178: v42.42,46.35 R1.2
  Bottom 0.178: JP1.2 v42.42,46.35
N$12  (via drill 0.3)
  Top 0.178: v40.64,45.72 D3.A 41.67,42.79 41.91,42.55 41.91,39.24 41.64,38.98 D2.A | v46.35,45.72 45.94,45.72 R1.1
  Bottom 0.178: v40.64,45.72 v46.35,45.72
N$13  (via drill 0.3)
  Top 0.178: v12.19,54.61 v12.2,54.61
  Top 0.508: v12.2,54.61 F1.2
  Bottom 0.508: X1.9 23.94,54.61 v12.19,54.61
N$14  (via drill 0.3)
  Top 0.178: R13.2 v34.29,28.57 | v40.64,25.4 U5.8
  Bottom 0.178: v34.29,28.57 37.21,28.57 40.39,25.4 v40.64,25.4
N$15  (via drill 0.3)
  Top 0.203: D4.C 27.42,45.84 v27.94,46.35
  Bottom 0.203: v27.94,46.35 JP2.2
N$16
  Top 0.508: F1.1 9.39,42.02 D1.A
N$17
  Top 0.178: J4.1 18.41,45.94 R3.2
N$21  (via drill 0.3)
  Top 0.178: U$1.2 v37.47,31.37 37.47,35.56 38.73,36.83 38.73,39.02 S1.2 | v42.55,30.77 42.45,30.87 U$1.10
  Bottom 0.178: v37.47,31.37 41.95,31.37 v42.55,30.77
OBD_LED
  Top 0.178: U$1.13 40.76,34.17 39.37,35.56 39.37,39.76 D3.C
PICO  (via drill 0.3)
  Top 0.178: U3.10 43.81,8.89 46.35,11.43 v46.35,20.32 | U2.14 23.5,26.67 22.23,25.4 v22.23,20.32
  Bottom 0.178: B1.D11 6.6,25.15 11.43,20.32 v22.23,20.32 v46.35,20.32
POCI  (via drill 0.3)
  Top 0.178: U3.12 43.81,11.43 45.09,12.7 v45.09,19.68 | U2.15 23.5,27.94 21.59,26.04 v21.59,19.68
  Bottom 0.178: B1.D12 8.51,22.61 11.43,19.68 v21.59,19.68 v45.09,19.68
RESET  (via drill 0.3)
  Top 0.178: U2.17 21.59,30.48 20.32,29.21 v20.32,18.41 | S3.1 S3.2 12.32,18.03 v12.7,18.41 | B1.RES 48.9,21.97 v48.9,15.88
  Bottom 0.178: v48.9,15.88 48.26,16.51 22.23,16.51 v20.32,18.41 v12.7,18.41
SCK  (via drill 0.3)
  Top 0.178: U3.11 43.81,10.16 45.72,12.06 v45.72,19.05 | U2.13 23.5,25.4 22.86,24.77 v22.86,19.05
  Bottom 0.178: B1.D13 10.41,20.07 11.43,19.05 v22.86,19.05 v45.72,19.05
SD_CS  (via drill 0.3)
  Top 0.178: v40.01,26.8 40.01,13.97 41.27,12.7 U3.13
  Bottom 0.178: B1.D9 3.94,28.57 31.75,28.57 32.38,29.21 37.59,29.21 v40.01,26.8

### Text on the board
Bottom: v20